# EAGLE design page1 (EAGLE 4.16)
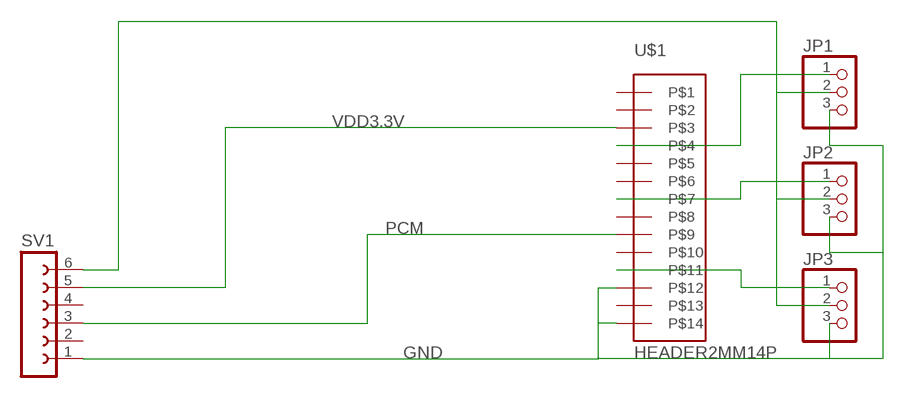
[diagram p0: schematic, sheet 1]

## Parts
JP1  PINHD-1X3  [1X03]
JP2  PINHD-1X3  [1X03]
JP3  PINHD-1X3  [1X03]
SV1  FE06-1  [FE06]
U$1  HEADER2MM14P  [HEADER2MM14P]

## Nets
GND: JP1.3 JP2.3 JP3.3 SV1.1 U$1.P$12 U$1.P$14
N$2: JP2.1 U$1.P$7
N$3: JP3.1 U$1.P$11
N$5: JP1.1 U$1.P$4
PCM: SV1.3 U$1.P$9
VCC5V: JP1.2 JP2.2 JP3.2 SV1.6
VDD3.3V: SV1.5 U$1.P$3
Unconnected: SV1.2 SV1.4 U$1.P$1 U$1.P$2 U$1.P$5 U$1.P$6 U$1.P$8 U$1.P$10 U$1.P$13

## Library data of the parts
JP1-JP3 = Headers:PINHD-1X3: PIN HEADER
SV1 = con-lsta:FE06-1: FEMALE HEADER
U$1 = Stofer:HEADER2MM14P

## Board
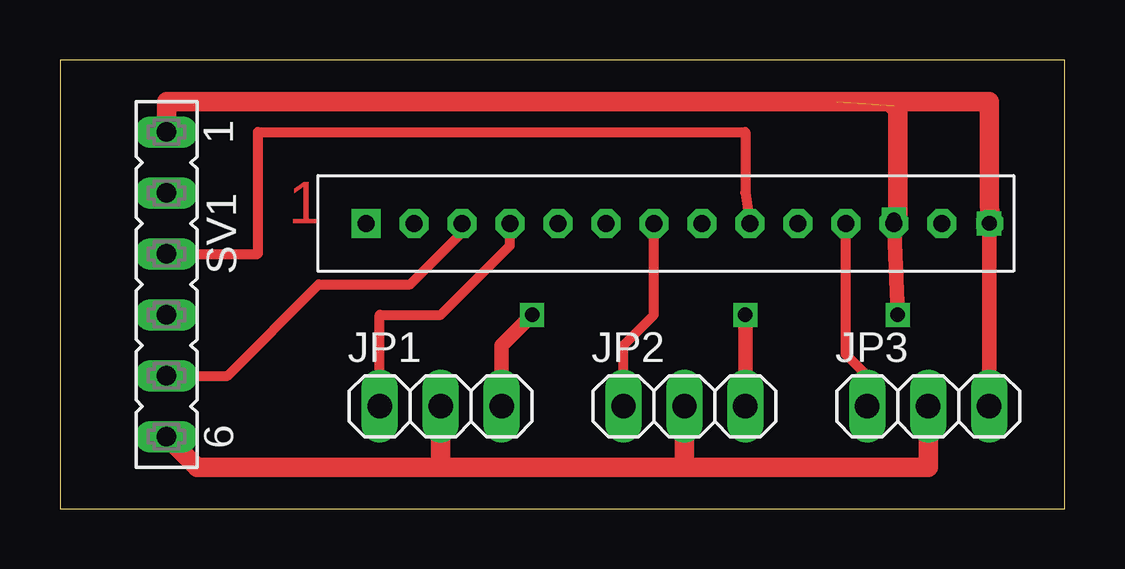
[diagram p1: board, top side]
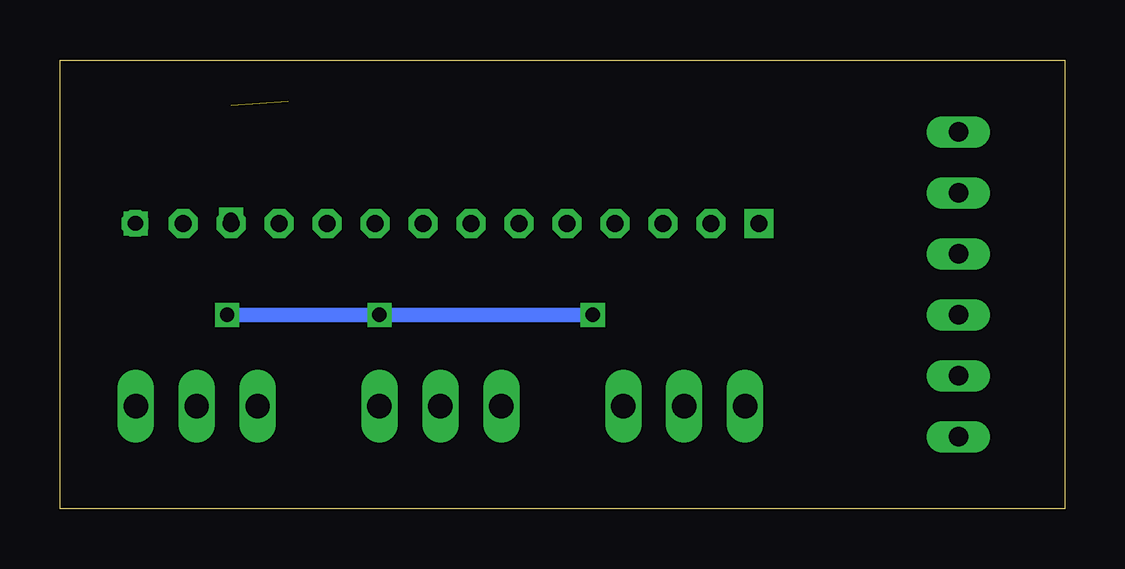
[diagram p2: board, bottom side, seen from below]

Size 41.89 x 18.72 mm. Coordinates in mm from the lower left corner, seen from the top.
Outline: 0,0 41.89,0 41.89,18.72 0,18.72 0,0
Copper layers (1*2+15*16): Top 0.035mm / dielectric 0.2mm / Route2 0.035mm / dielectric 0.15mm / Route15 0.035mm / dielectric 0.2mm / Bottom 0.035mm
Design rules "default": minimum track width 10mil, minimum drill 24mil, track to track 8mil, track to pad 8mil, pad to pad 8mil, via to via 8mil, smd to smd 8mil, copper to edge 40mil, drill to drill 8mil, minimum pad ring 10mil, minimum via ring 8mil, stop-mask expansion 4mil, vias tented up to drill 0mil, thermal gap 10mil

### Footprints (pad centres in the part's own frame; a part is rotated, then mirrored left to right if it is on the bottom)
1X03 = drill 1.016 long: 1 -2.54,0; 2 0,0; 3 2.54,0
FE06 = drill 0.813 long: 1 -6.35,0; 2 -3.81,0; 3 -1.27,0; 4 1.27,0; 5 3.81,0; 6 6.35,0
HEADER2MM14P = drill 0.7 square: P$1 0,12 | drill 0.7 octagon: P$2 0,10; P$3 0,8; P$4 0,6; P$5 0,4; P$6 0,2; P$7 0,0; P$8 0,-2; P$9 0,-4; P$10 0,-6; P$11 0,-8; P$12 0,-10; P$13 0,-12 | drill 0.6 octagon: P$14 0,-14

### Placement (x,y rotation side)
JP1  15.87,4.28 0 top
JP2  26.03,4.28 0 top
JP3  36.19,4.28 0 top
SV1  4.44,9.36 270 top
U$1  24.76,11.9 90 top

### Tracks (layer width: path | path; a pad name or v marks a point on that pad's centre or on a via)
GND  (via drill 0.6)  (1 unrouted)
  Top 0.406: U$1.P$12 34.92,11.9
  Top 0.61: v34.92,8.09 v34.76,12.06 | JP1.3 18.41,6.82 v19.68,8.09 | v28.57,8.09 JP2.3 | v38.73,11.9 JP3.3
  Top 0.813: SV1.1 4.44,16.98 32.38,16.98 38.73,16.98 38.73,13.17 U$1.P$14 | v34.76,12.06 34.92,12.06 34.92,11.9 34.92,16.82 34.76,16.82
  Bottom 0.61: v34.76,12.06 U$1.P$12 | U$1.P$14 v38.73,11.9 | v19.68,8.09 v28.57,8.09 v34.92,8.09
  Bottom 0.813: v34.76,12.06 U$1.P$12
N$2
  Top 0.406: U$1.P$7 24.76,8.09 23.49,6.82 JP2.1
N$3
  Top 0.406: U$1.P$11 32.76,6.44 33.65,5.55 JP3.1
N$5
  Top 0.406: U$1.P$4 18.76,10.98 15.87,8.09 13.33,8.09 JP1.1
PCM
  Top 0.406: SV1.3 8.25,10.63 8.25,15.71 28.57,15.71 28.57,13.17 U$1.P$9
VCC5V
  Top 0.813: SV1.6 5.71,1.74 15.87,1.74 | 15.87,1.74 26.03,1.74 | 26.03,1.74 36.19,1.74 JP3.2 | 15.87,1.74 JP1.2 | 26.03,1.74 JP2.2
VDD3.3V
  Top 0.406: SV1.5 6.98,5.55 10.79,9.36 14.6,9.36 16.76,11.52 U$1.P$3

### Text on the board
Top: 1